# Altium project Converter.PrjPcb
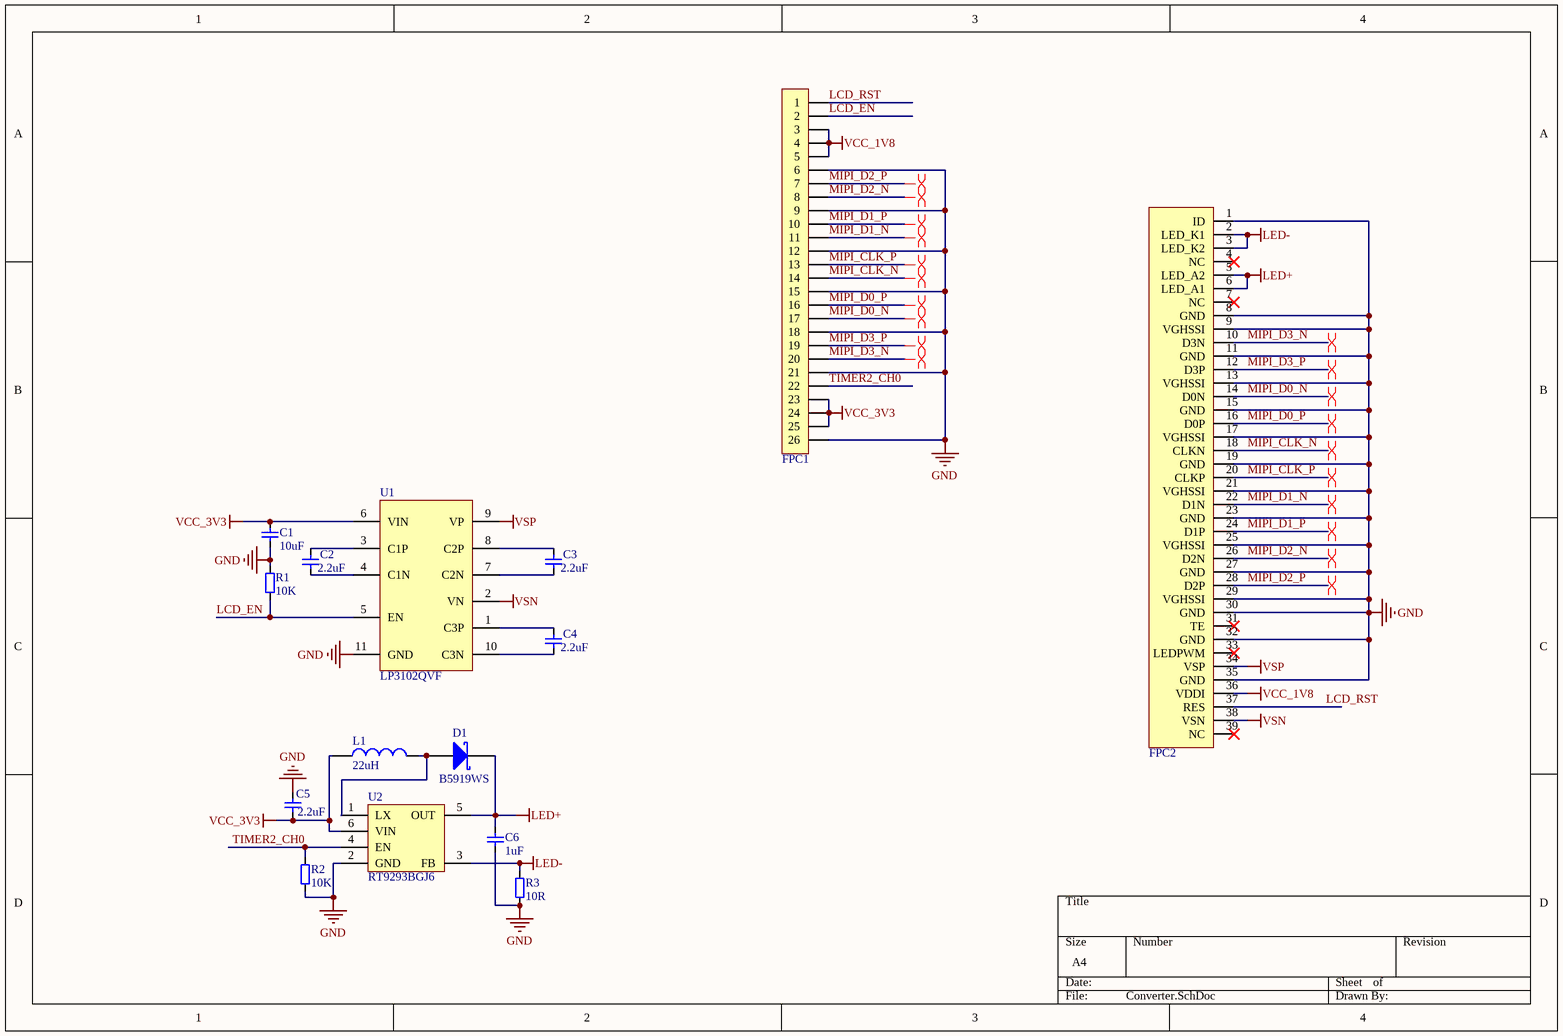
[diagram p0: Converter.SchDoc]
1 sheet, 15 parts. Net scope: global (net labels, ports and power ports of the same name join across sheets).
Board file: Converter.PcbDoc

## Sheet Converter.SchDoc
size A4; SheetNumber: 1; SheetTotal: 1

### Parts
C1  10uF  [C0402_L]
C2  2.2uF  [C0402_L]
C3  2.2uF  [C0402_L]
C4  2.2uF  [C0402_L]
C5  2.2uF  [C0402_L]
C6  1uF  [C0402_L]
D1  B5919WS  [SOD-323]
FPC1  FPC1.0-26P  [FPC0.5 2H-WS-26P]  (value not drawn)
FPC2  LQ055T3SX02Z  [FPC0.5 2H-WS-39P]  (value not drawn)
L1  22uH  [SWPA5040]
R1  10K  [R0402_L]
R2  10K  [R0402_L]
R3  10R  [R0603_L]
U1  LP3102QVF  [LP3102]
U2  RT9293BGJ6  [RT9293BGJ6]

### Nets
GND: C1.2 C5.1 C6.1 FPC1.6 FPC1.9 FPC1.12 FPC1.15 FPC1.18 FPC1.21 FPC1.26 FPC2.1(ID) FPC2.8(GND) FPC2.9(VGHSSI) FPC2.11(GND) FPC2.13(VGHSSI) FPC2.15(GND) FPC2.17(VGHSSI) FPC2.19(GND) FPC2.21(VGHSSI) FPC2.23(GND) FPC2.25(VGHSSI) FPC2.27(GND) FPC2.29(VGHSSI) FPC2.30(GND) FPC2.32(GND) FPC2.35(GND) R1.1 R2.2 R3.2 U1.11(GND) U2.2(GND)
LED+: C6.2 D1.2(K) FPC2.5(LED_A2) FPC2.6(LED_A1) U2.5(OUT)
LED-: FPC2.2(LED_K1) FPC2.3(LED_K2) R3.1 U2.3(FB)
VCC_1V8: FPC1.3 FPC1.4 FPC1.5 FPC2.36(VDDI)
VCC_3V3: C1.1 C5.2 FPC1.23 FPC1.24 FPC1.25 L1.1 U1.6(VIN) U2.6(VIN)
VSN: FPC2.38(VSN) U1.2(VN)
VSP: FPC2.34(VSP) U1.9(VP)
LCD_EN: FPC1.2 R1.2 U1.5(EN)
LCD_RST: FPC1.1 FPC2.37(RES)
MIPI_CLK_N: FPC1.14 FPC2.18(CLKN)
MIPI_CLK_P: FPC1.13 FPC2.20(CLKP)
MIPI_D0_N: FPC1.17 FPC2.14(D0N)
MIPI_D0_P: FPC1.16 FPC2.16(D0P)
MIPI_D1_N: FPC1.11 FPC2.22(D1N)
MIPI_D1_P: FPC1.10 FPC2.24(D1P)
MIPI_D2_N: FPC1.8 FPC2.26(D2N)
MIPI_D2_P: FPC1.7 FPC2.28(D2P)
MIPI_D3_N: FPC1.20 FPC2.10(D3N)
MIPI_D3_P: FPC1.19 FPC2.12(D3P)
TIMER2_CH0: FPC1.22 R2.1 U2.4(EN)
NetC2_1: C2.1 U1.4(C1N)
NetC2_2: C2.2 U1.3(C1P)
NetC3_1: C3.1 U1.7(C2N)
NetC3_2: C3.2 U1.8(C2P)
NetC4_1: C4.1 U1.10(C3N)
NetC4_2: C4.2 U1.1(C3P)
NetD1_1: D1.1(A) L1.2 U2.1(LX)

Not connected (* = marked no-connect by the designer): FPC2 4(NC)* 7(NC)* 31(TE)* 33(LEDPWM)* 39(NC)*

### Layout directives
differential pair: MIPI_CLK_N, MIPI_CLK_P, MIPI_D0_N, MIPI_D0_P, MIPI_D1_N, MIPI_D1_P, MIPI_D2_N, MIPI_D2_P, MIPI_D3_N, MIPI_D3_P

### Library data of the parts
C1-C6 = C: 贴片电容; BOM名称: 无极性贴片电容; 联系卖家，免费查找封装: 唯一出售店铺网址https://shop463601444.taobao.com
D1 = 1N5819: 肖特基二极管; 联系卖家，免费查找封装: 唯一出售店铺网址https://shop463601444.taobao.com; BOM名称: 肖特基二极管
FPC1 = FPC-26P: FPC连接器; 版权归属: 源创客; BOM名称: FPC连接器; 学习资源: www.ooocke.com
FPC2 = LQ055T3SX02Z: 5.5寸显示屏; BOM名称: FPC连接器; 版权归属: 源创客; 学习资源: www.ooocke.com
L1 = L: 贴片小功率电感; BOM名称: 小功率贴片电感; 联系卖家，免费查找封装: 唯一出售店铺网址https://shop463601444.taobao.com; 封装库来自淘宝卖家ID：黄晶宝石: 其他店铺购入均为盗版假冒封装库，请立即申请退款
R1-R3 = R: 贴片电阻; 联系卖家，免费查找封装: 唯一出售店铺网址https://shop463601444.taobao.com; 封装库来自淘宝卖家ID：黄晶宝石: 其他店铺购入均为盗版假冒封装库，请立即申请退款; BOM名称: 贴片电阻
U1 = LP3102QVF: C517005
U2 = RT9293BGJ6: 异步升压的LED驱动器 C36462